# Altium project GB-Drone_master_main.PrjPcb
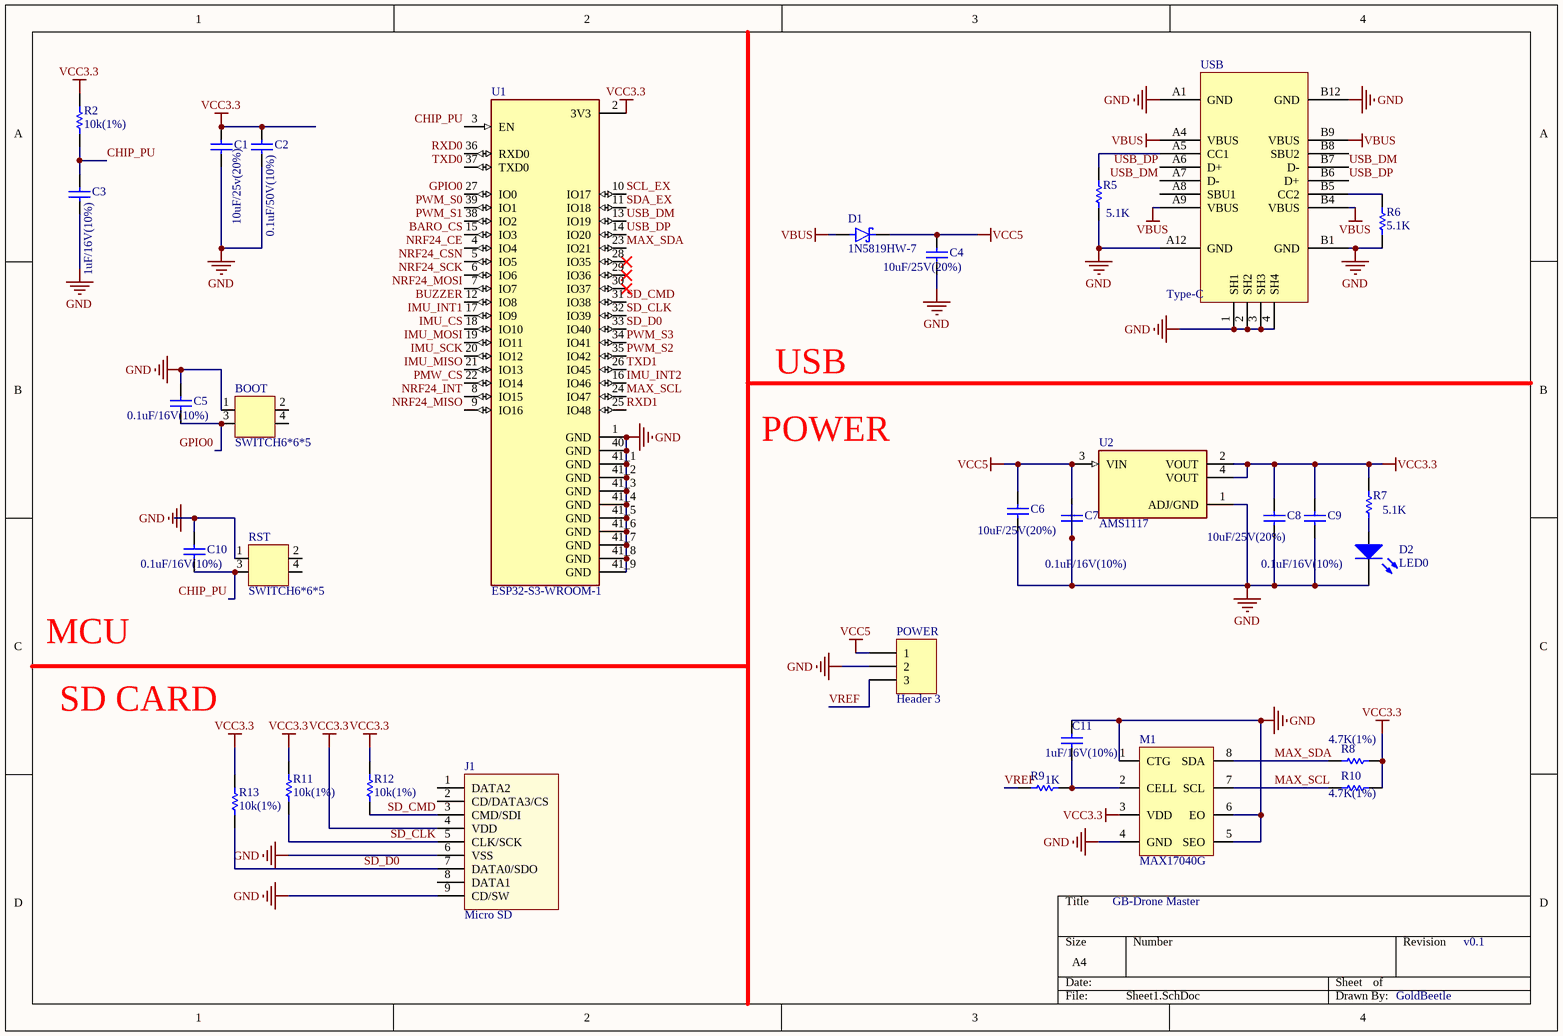
[diagram p0: Sheet1.SchDoc]
2 sheets, 45 parts. Net scope: global (net labels, ports and power ports of the same name join across sheets).
Board file: PCB1.PcbDoc
Sheets:
  Sheet1.SchDoc
  Sheet2.SchDoc

## Sheet Sheet1.SchDoc
size A4; SheetNumber: 1; SheetTotal: 2

### Parts
BOOT  SWITCH6*6*5  [SWITCH6*6*5]
C1  10uF/25v(20%)  [C0805]
C2  0.1uF/50V(10%)  [C0805]
C3  value 1uF/16V(10%)  [C0805]  (hidden comment: 0.1uF/50V(10%))
C4  10uF/25V(20%)  [C0805]
C5  0.1uF/16V(10%)  [C0805]
C6  10uF/25V(20%)  [C0805]
C7  0.1uF/16V(10%)  [C0805]
C8  10uF/25V(20%)  [C0805]
C9  0.1uF/16V(10%)  [C0805]
C10  0.1uF/16V(10%)  [C0805]
C11  1uF/16V(10%)  [C0805]
D1  1N5819HW-7  [SOD3715X145N]
D2  LED0  [C0805]
J1  Micro SD  [Micro SD]
M1  MAX17040G  [MAX17040G+T]
POWER  Header 3  [POWER-3P]
R2  10k(1%)  [C0805]
R5  5.1K  [C0805]
R6  5.1K  [C0805]
R7  5.1K  [C0805]
R8  4.7K(1%)  [C0805]
R9  1K  [C0805]
R10  4.7K(1%)  [C0805]
R11  10k(1%)  [C0805]
R12  10k(1%)  [C0805]
R13  10k(1%)  [C0805]
RST  SWITCH6*6*5  [SWITCH6*6*5]
U1  ESP32-S3-WROOM-1  [ESP32-S3-WROOM-1-N16R8]
U2  AMS1117  [SOT229P700X180-4N]
USB  Type-C  [Type-C-TOP]

### Nets
GND: BOOT.1 C1.1 C2.1 C3.1 C4.1 C5.1 C6.1 C7.1 C8.1 C9.1 C10.1 C11.2 D2.2(K) J1.6(VSS) J1.9(CD/SW) M1.1(CTG) M1.4(GND) M1.5(SEO) M1.6(EO) POWER.2 R5.1 R6.1 RST.1 U1.1(GND) U1.40(GND) U1.41_1(GND) U1.41_2(GND) U1.41_3(GND) U1.41_4(GND) U1.41_5(GND) U1.41_6(GND) U1.41_7(GND) U1.41_8(GND) U1.41_9(GND) U2.1(ADJ/GND) USB.1(SH1) USB.2(SH2) USB.3(SH3) USB.4(SH4) USB.A1(GND) USB.A12(GND) USB.B1(GND) USB.B12(GND)
VBUS: D1.A USB.A4(VBUS) USB.A9(VBUS) USB.B4(VBUS) USB.B9(VBUS)
VCC3.3: C1.2 C2.2 C8.2 C9.2 J1.4(VDD) M1.3(VDD) R2.2 R7.1 R8.2 R10.2 R11.2 R12.2 R13.2 U1.2(3V3) U2.2(VOUT) U2.4(VOUT)
VCC5: C4.2 C6.2 C7.2 D1.C(K) POWER.1 U2.3(VIN)
BARO_CS: U1.15(IO3)
BUZZER: U1.12(IO8)
CHIP_PU: C3.2 C10.2 R2.1 RST.3 U1.3(EN)
GPIO0: BOOT.3 C5.2 U1.27(IO0)
IMU_CS: U1.18(IO10)
IMU_INT1: U1.17(IO9)
IMU_INT2: U1.16(IO46)
IMU_MISO: U1.21(IO13)
IMU_MOSI: U1.19(IO11)
IMU_SCK: U1.20(IO12)
MAX_SCL: M1.7(SCL) R10.1 U1.24(IO47)
MAX_SDA: M1.8(SDA) R8.1 U1.23(IO21)
NRF24_CE: U1.4(IO4)
NRF24_CSN: U1.5(IO5)
NRF24_INT: U1.8(IO15)
NRF24_MISO: U1.9(IO16)
NRF24_MOSI: U1.7(IO7)
NRF24_SCK: U1.6(IO6)
PMW_CS: U1.22(IO14)
PWM_S0: U1.39(IO1)
PWM_S1: U1.38(IO2)
PWM_S2: U1.35(IO42)
PWM_S3: U1.34(IO41)
RXD0: U1.36(RXD0)
RXD1: U1.25(IO48)
SCL_EX: U1.10(IO17)
SD_CLK: J1.5(CLK/SCK) R11.1 U1.32(IO39)
SD_CMD: J1.3(CMD/SDI) R12.1 U1.31(IO38)
SD_D0: J1.7(DATA0/SDO) R13.1 U1.33(IO40)
SDA_EX: U1.11(IO18)
TXD0: U1.37(TXD0)
TXD1: U1.26(IO45)
USB_DM: U1.13(IO19) USB.A7(D-) USB.B7(D-)
USB_DP: U1.14(IO20) USB.A6(D+) USB.B6(D+)
VREF: POWER.3 R9.1
NetC11_1: C11.1 M1.2(CELL) R9.2
NetD2_1: D2.1(A) R7.2
NetR5_2: R5.2 USB.A5(CC1)
NetR6_2: R6.2 USB.B5(CC2)

Not connected (* = marked no-connect by the designer): BOOT 2 4; J1 1(DATA2) 2(CD/DATA3/CS) 8(DATA1); RST 2 4; U1 28(IO35)* 29(IO36)* 30(IO37)*; USB A8(SBU1) B8(SBU2)

### Notes on the sheet
- USB
- POWER
- MCU
- SD CARD
- GB-Drone Master
- v0.1
- GoldBeetle

### Library data of the parts
C1-C11 = Cap: Capacitor; Published: 8-Jun-2000; LatestRevisionDate: 17-Jul-2002; LatestRevisionNote: Re-released for DXP Platform.; PackageReference: RAD-0.3; Publisher: Altium Limited; PackageDescription: Radial Cap, Thru-Hole; 2 Leads; 0.3 in Pin Spacing
  C1: Value: 10uF/25v(20%)
  C2: Value: 0.1uF/50V(10%)
D1 = 1N5819HW-7: Diode Schottky 40 V 1A Surface Mount SOD-123; MF: Diodes Inc.; SnapEDA_Link: https://www.snapeda.com/parts/1N5819HW-7/Diodes+Inc./view-part/?ref=snap; Price: None; Check_prices: https://www.snapeda.com/parts/1N5819HW-7/Diodes+Inc./view-part/?ref=eda; Availability: In Stock; Value: *; MP: 1N5819HW-7; Package: SOD-123 Fairchild Semiconductor; Purchase-URL: https://pricing.snapeda.com/search/part/1N5819HW-7/?ref=eda
D2 = LED0: Typical INFRARED GaAs LED; Published: 8-Jun-2000; LatestRevisionDate: 08-Jul-2005; LatestRevisionNote: Mech Layer 1 removed.; PackageReference: LED-0; Publisher: Altium Limited; PackageDescription: LED; 2 Leads
J1 = Micro SD: Micro SD卡; 版权归属: 源创客; BOM名称: Micro SD卡; 学习资源: www.ooocke.com
M1 = MAX17040G: 电量检测
POWER = Header 3: Header, 3-Pin; LatestRevisionDate: 17-Jul-2002; LatestRevisionNote: Re-released for DXP Platform.; Publisher: Altium Limited
R2 R5-R13 = Res1: Resistor; Published: 8-Jun-2000; LatestRevisionDate: 17-Jul-2002; LatestRevisionNote: Re-released for DXP Platform.; PackageReference: AXIAL-0.3; Publisher: Altium Limited; PackageDescription: Axial Device, Thru-Hole; 2 Leads; 0.3 in Pin Spacing
U1 = ESP32-S3-WROOM-1: Bluetooth, WiFi 802.11b/g/n, Bluetooth v5.0 Transceiver Module 2.4GHz PCB Trace Surface Mount; MP: ESP32-S3-WROOM-1-N8R8; MF: Espressif Systems; Price: None; Availability: In Stock; Package: None; Value: *; SnapEDA_Link: https://www.snapeda.com/parts/ESP32-S3-WROOM-1-N8R8/Espressif+Systems/view-part/?ref=snap; Check_prices: https://www.snapeda.com/parts/ESP32-S3-WROOM-1-N8R8/Espressif+Systems/view-part/?ref=eda; Purchase-URL: https://pricing.snapeda.com/search/part/ESP32-S3-WROOM-1-N8R8/?ref=eda
U2 = AMS1117: UNO PLUS Arduino R3 Shield, Xbee Arduino IDE Wheeled Robotics Kit; MF: Seeed Technology; Availability: Unavailable; SnapEDA_Link: https://www.snapeda.com/parts/AMS1117/Seeed%20Technology%20Co.%2C%20Ltd/view-part/184428/?ref=snap; MP: AMS1117; Price: None; Value: *; Package: SOT-223 Seeed Technology
USB = USB-Type-C-TOP

## Sheet Sheet2.SchDoc
size A4; SheetNumber: 2; SheetTotal: 2
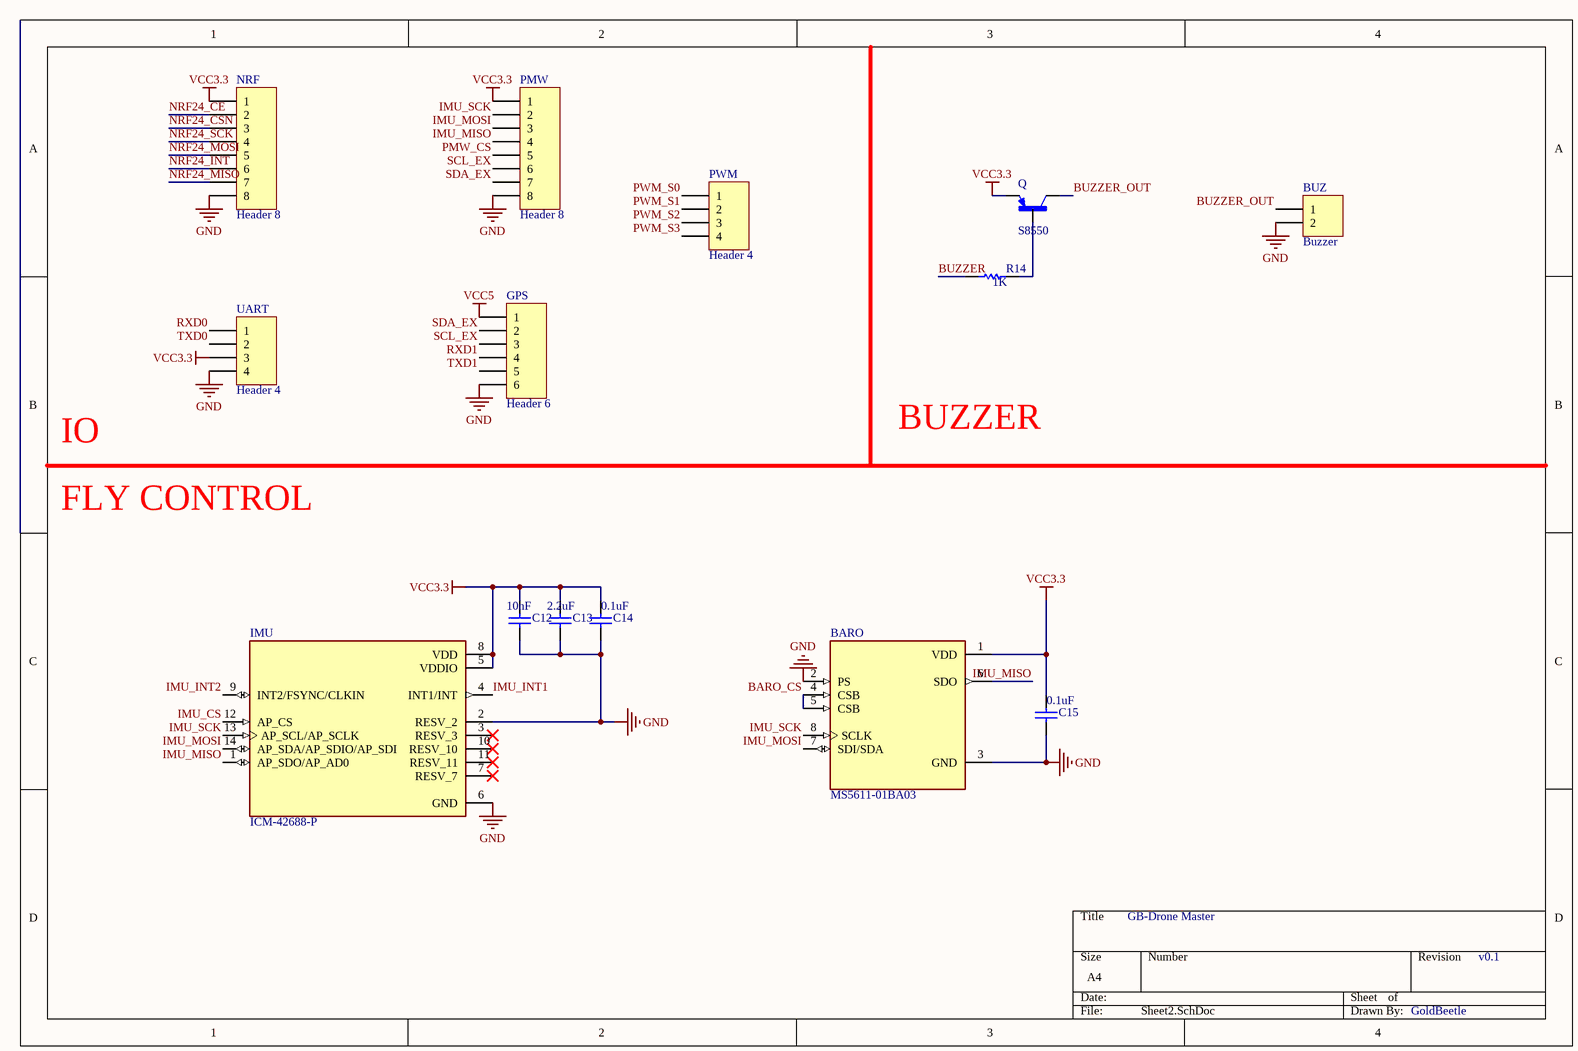
[diagram p1: Sheet2.SchDoc]

### Parts
BARO  MS5611-01BA03  [MS5611-SON125P500X300X100-8N]
BUZ  Buzzer  [POWER-2P]
C12  value 10nF  [C0805]  (hidden comment: 0.1uF/50V(10%))
C13  value 2.2uF  [C0805]  (hidden comment: 10uF/25v(20%))
C14  value 0.1uF  [C0805]  (hidden comment: 0.1uF/50V(10%))
C15  value 0.1uF  [C0805]  (hidden comment: 0.1uF/50V(10%))
GPS  Header 6  [SIGNAL-6P]
IMU  ICM-42688-P  [ICM42688-PQFN50P300X250X97-14N]
NRF  Header 8  [SIGNAL-8P]
PMW  Header 8  [SIGNAL-8P]
PWM  Header 4  [SIGNAL-4P]
Q  S8550  [SOT-23_S8550]
R14  1K  [C0805]
UART  Header 4  [HDR2X2]

### Nets
GND: BARO.2(PS) BARO.3(GND) BUZ.2 C12.2 C13.1 C14.2 C15.2 GPS.6 IMU.2(RESV_2) IMU.6(GND) NRF.8 PMW.8 UART.4
VCC3.3: BARO.1(VDD) C12.1 C13.2 C14.1 C15.1 IMU.5(VDDIO) IMU.8(VDD) NRF.1 PMW.1 Q.2(E) UART.3
VCC5: GPS.1
BARO_CS: BARO.4(CSB) BARO.5(CSB)
BUZZER: R14.1
BUZZER_OUT: BUZ.1 Q.3(C)
IMU_CS: IMU.12(AP_CS)
IMU_INT1: IMU.4(INT1/INT)
IMU_INT2: IMU.9(INT2/FSYNC/CLKIN)
IMU_MISO: BARO.6(SDO) IMU.1(AP_SDO/AP_AD0) PMW.4
IMU_MOSI: BARO.7(SDI/SDA) IMU.14(AP_SDA/AP_SDIO/AP_SDI) PMW.3
IMU_SCK: BARO.8(SCLK) IMU.13(AP_SCL/AP_SCLK) PMW.2
NRF24_CE: NRF.2
NRF24_CSN: NRF.3
NRF24_INT: NRF.6
NRF24_MISO: NRF.7
NRF24_MOSI: NRF.5
NRF24_SCK: NRF.4
PMW_CS: PMW.5
PWM_S0: PWM.1
PWM_S1: PWM.2
PWM_S2: PWM.3
PWM_S3: PWM.4
RXD0: UART.1
RXD1: GPS.4
SCL_EX: GPS.3 PMW.6
SDA_EX: GPS.2 PMW.7
TXD0: UART.2
TXD1: GPS.5
NetQ_1: Q.1(B) R14.2

Not connected (* = marked no-connect by the designer): IMU 3(RESV_3)* 7(RESV_7)* 10(RESV_10)* 11(RESV_11)*

### Notes on the sheet
- IO
- BUZZER
- FLY CONTROL
- GB-Drone Master
- v0.1
- GoldBeetle

### Library data of the parts
BARO = MS5611-01BA03: Pressure Sensor 0.15PSI ~ 17.4PSI (1kPa ~ 120kPa) Absolute - 24 b 8-SMD; MF: TE Connectivity; Package: SMD-8 Measurement Specialties; Price: None; Value: *; SnapEDA_Link: https://www.snapeda.com/parts/MS5611-01BA03/TE+Connectivity+ALCOSWITCH+Switches/view-part/?ref=snap; MP: MS5611-01BA03; Availability: Not in stock; Check_prices: https://www.snapeda.com/parts/MS5611-01BA03/TE+Connectivity+ALCOSWITCH+Switches/view-part/?ref=eda
BUZ = Header 2: Header, 2-Pin; LatestRevisionDate: 17-Jul-2002; LatestRevisionNote: Re-released for DXP Platform.; Publisher: Altium Limited
C12-C15 = Cap: Capacitor; Published: 8-Jun-2000; LatestRevisionDate: 17-Jul-2002; LatestRevisionNote: Re-released for DXP Platform.; PackageReference: RAD-0.3; Publisher: Altium Limited; PackageDescription: Radial Cap, Thru-Hole; 2 Leads; 0.3 in Pin Spacing
GPS = Header 6: Header, 6-Pin; LatestRevisionDate: 17-Jul-2002; LatestRevisionNote: Re-released for DXP Platform.; Publisher: Altium Limited
IMU = ICM-42688-P: Accelerometer, Gyroscope, 6 Axis Sensor Output; Package: None; MP: ICM-42688-P; Value: *; Availability: Unavailable; Price: None
NRF PMW = Header 8: Header, 8-Pin; LatestRevisionDate: 17-Jul-2002; LatestRevisionNote: Re-released for DXP Platform.; Publisher: Altium Limited
PWM UART = Header 4: Header, 4-Pin; LatestRevisionDate: 17-Jul-2002; LatestRevisionNote: Re-released for DXP Platform.; Publisher: Altium Limited
Q = S8550: Bipolar (BJT) Transistor PNP 25 V 500 mA 150MHz 300 mW Surface Mount SOT-23; MF: MDD; SnapEDA_Link: https://www.snapeda.com/parts/S8550/MDD/view-part/?ref=snap; Package: SOT-23 MDD; Value: *; MP: S8550; Check_prices: https://www.snapeda.com/parts/S8550/MDD/view-part/?ref=eda
R14 = Res1: Resistor; Published: 8-Jun-2000; LatestRevisionDate: 17-Jul-2002; LatestRevisionNote: Re-released for DXP Platform.; PackageReference: AXIAL-0.3; Publisher: Altium Limited; PackageDescription: Axial Device, Thru-Hole; 2 Leads; 0.3 in Pin Spacing

## Nets that join several sheets
GND: Sheet1 (43 pins), Sheet2 (13 pins)
VCC3.3: Sheet1 (16 pins), Sheet2 (11 pins)
VCC5: Sheet1 (6 pins), Sheet2 (GPS.1)
BARO_CS: Sheet1 (U1.15), Sheet2 (BARO.4 BARO.5)
BUZZER: Sheet1 (U1.12), Sheet2 (R14.1)
IMU_CS: Sheet1 (U1.18), Sheet2 (IMU.12)
IMU_INT1: Sheet1 (U1.17), Sheet2 (IMU.4)
IMU_INT2: Sheet1 (U1.16), Sheet2 (IMU.9)
IMU_MISO: Sheet1 (U1.21), Sheet2 (BARO.6 IMU.1 PMW.4)
IMU_MOSI: Sheet1 (U1.19), Sheet2 (BARO.7 IMU.14 PMW.3)
IMU_SCK: Sheet1 (U1.20), Sheet2 (BARO.8 IMU.13 PMW.2)
NRF24_CE: Sheet1 (U1.4), Sheet2 (NRF.2)
NRF24_CSN: Sheet1 (U1.5), Sheet2 (NRF.3)
NRF24_INT: Sheet1 (U1.8), Sheet2 (NRF.6)
NRF24_MISO: Sheet1 (U1.9), Sheet2 (NRF.7)
NRF24_MOSI: Sheet1 (U1.7), Sheet2 (NRF.5)
NRF24_SCK: Sheet1 (U1.6), Sheet2 (NRF.4)
PMW_CS: Sheet1 (U1.22), Sheet2 (PMW.5)
PWM_S0: Sheet1 (U1.39), Sheet2 (PWM.1)
PWM_S1: Sheet1 (U1.38), Sheet2 (PWM.2)
PWM_S2: Sheet1 (U1.35), Sheet2 (PWM.3)
PWM_S3: Sheet1 (U1.34), Sheet2 (PWM.4)
RXD0: Sheet1 (U1.36), Sheet2 (UART.1)
RXD1: Sheet1 (U1.25), Sheet2 (GPS.4)
SCL_EX: Sheet1 (U1.10), Sheet2 (GPS.3 PMW.6)
SDA_EX: Sheet1 (U1.11), Sheet2 (GPS.2 PMW.7)
TXD0: Sheet1 (U1.37), Sheet2 (UART.2)
TXD1: Sheet1 (U1.26), Sheet2 (GPS.5)